# Altium schematic sheet WiFiNode_Blk_R00.SchDoc: Nodo WiFi
size A4; Author: Hernan M. Travado; Revision: 0; SheetNumber: 1; SheetTotal: 5
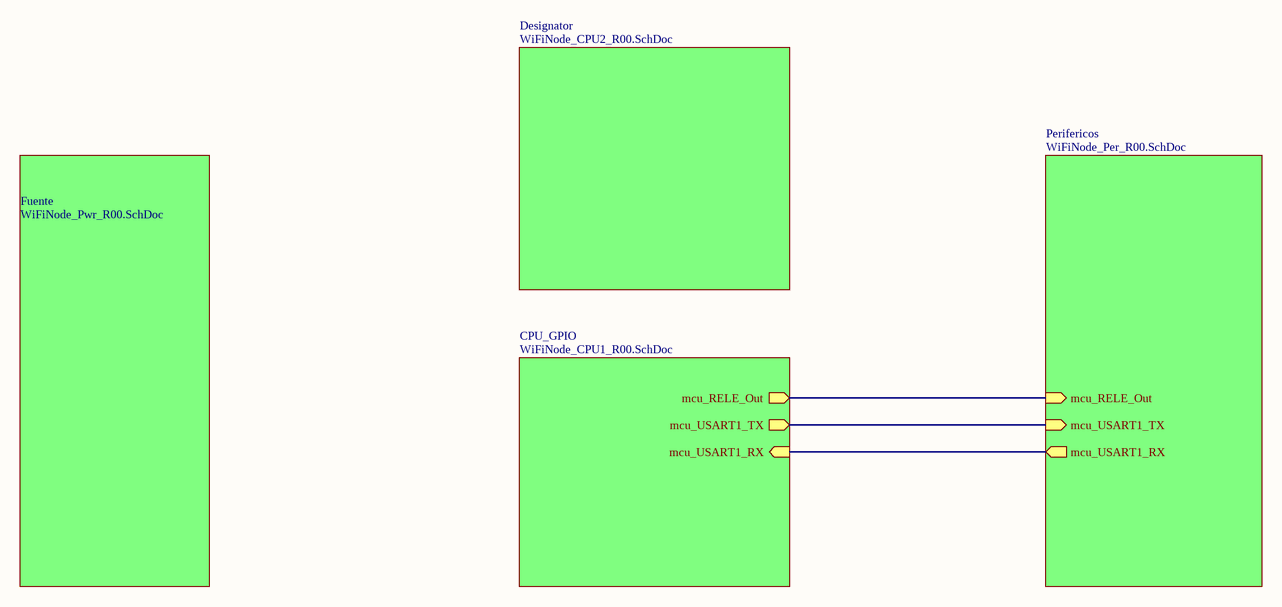
[diagram p0: WiFiNode_Blk_R00.SchDoc]

## Sub-sheets
CPU_GPIO = WiFiNode_CPU1_R00.SchDoc: mcu_RELE_Out (out), mcu_USART1_TX (out), mcu_USART1_RX (in)
Designator = WiFiNode_CPU2_R00.SchDoc: no entries
Fuente = WiFiNode_Pwr_R00.SchDoc: no entries
Perifericos = WiFiNode_Per_R00.SchDoc: mcu_RELE_Out (in), mcu_USART1_TX (in), mcu_USART1_RX (out)

## Nets
(unnamed): sheet CPU_GPIO/mcu_RELE_Out, sheet Perifericos/mcu_RELE_Out
(unnamed): sheet CPU_GPIO/mcu_USART1_TX, sheet Perifericos/mcu_USART1_TX
(unnamed): sheet CPU_GPIO/mcu_USART1_RX, sheet Perifericos/mcu_USART1_RX

## Notes on the sheet
- Title:
- Size:
- Author:
- A4
- Sheet
- of
- Revision:
- File:
- Date: